# Altium project ESP32_S3_ETHERNET.PrjPcb
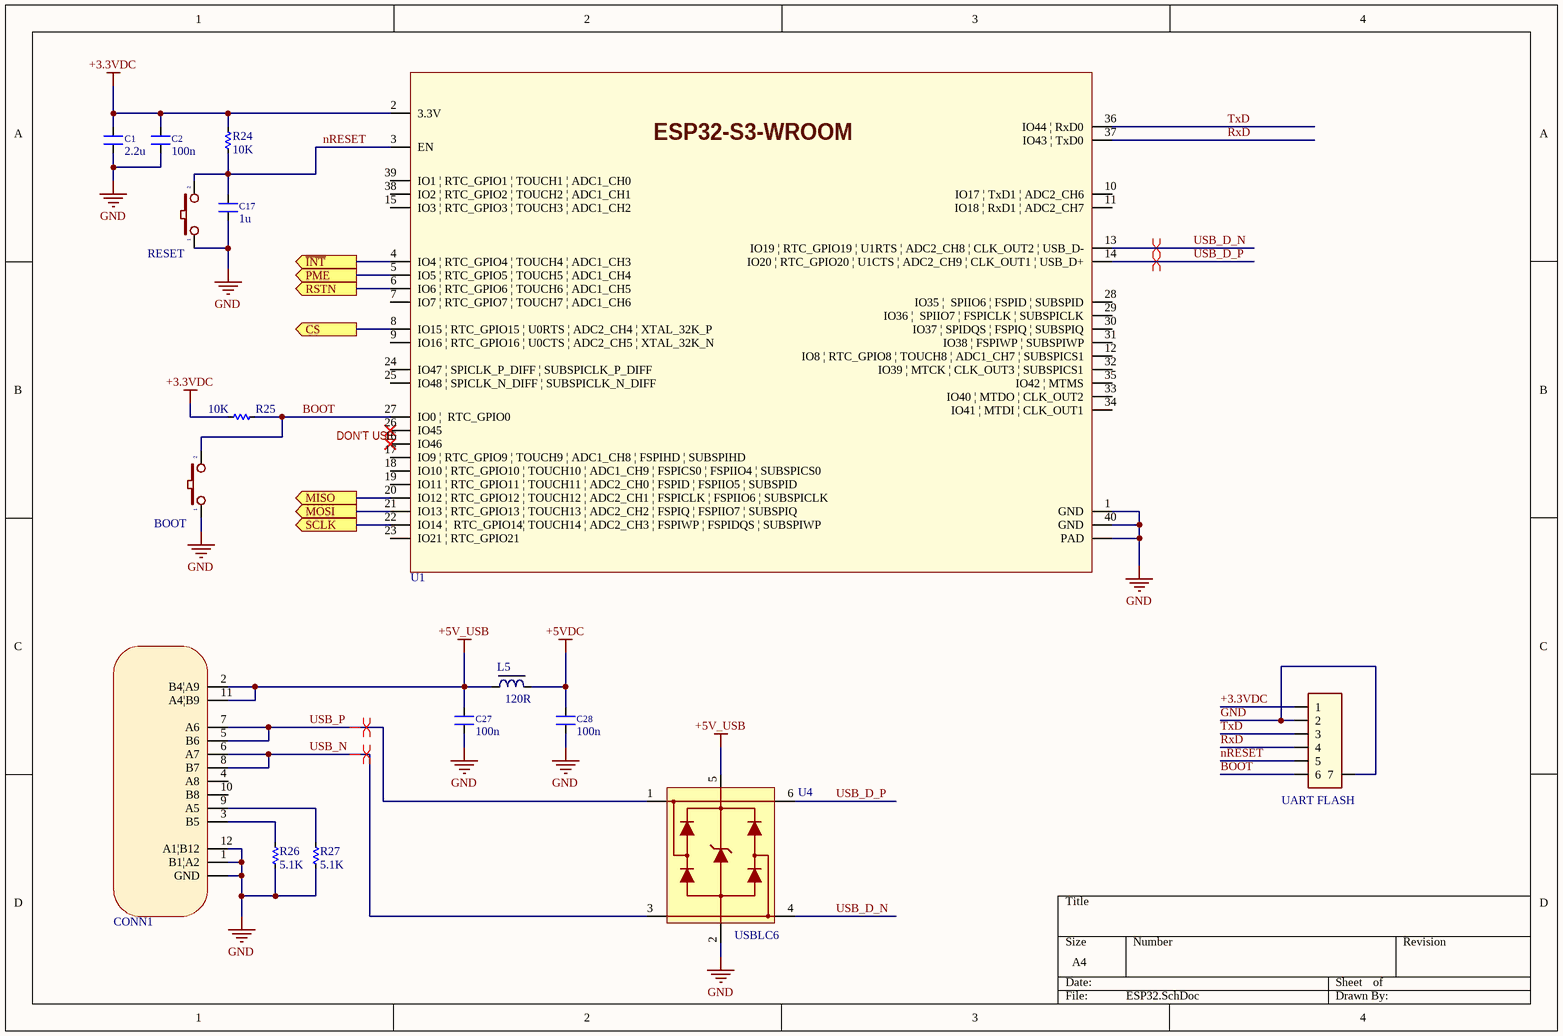
[diagram p0: ESP32.SchDoc]
3 sheets, 86 parts. Net scope: flat (ports and power ports of the same name join across sheets).
Board file: V1.0.PcbDoc
Sheets:
  ESP32.SchDoc
  KSZ8851SNL.SchDoc
  POWER.SchDoc

## Sheet ESP32.SchDoc
size A4; SheetNumber: 1; SheetTotal: 3

### Parts
BOOT  BUTTON1  [SW-SMD - 3x4]  (value not drawn)
C1  2.2u  [CN-SMD-0805]
C2  100n  [CN-SMD-0603]
C17  1u  [CN-SMD-0603]
C27  100n  [CN-SMD-0603]
C28  100n  [CN-SMD-0603]
CONN1  USB-C3.1 12PIN  [TYPE-C-31-M-12]  (value not drawn)
L5  120R  [IN-SMD-0603]
R24  10K  [RES-SMD-0603]
R25  10K  [RES-SMD-0603]
R26  5.1K  [RES-SMD-0603]
R27  5.1K  [RES-SMD-0603]
RESET  BUTTON1  [SW-SMD - 3x4]  (value not drawn)
U1  ESP32 S3  [ESP32-S3-WROOM-1/1U]  (value not drawn)
U4  USBLC6  [SOT23-6]
UART_FLASH  CONNECTOR 6P  [JST-PH2.0_6P]  (value not drawn)

### Ports
CS (out), MISO (out), MOSI (out), PME (out), RSTN (out), SCLK (out), ~{INT} (out)

### Nets
+3.3VDC: C1.2 C2.2 R24.2 R25.2 U1.2(3.3V) UART_FLASH.1
+5V_USB: C27.2 CONN1.2(B4|A9) CONN1.11(A4|B9) L5.1 U4.5
+5VDC: C28.2 L5.2
GND: BOOT.1 C1.1 C2.1 C17.1 C27.1 C28.1 CONN1.1(B1|A2) CONN1.12(A1|B12) CONN1.GND R26.2 R27.2 RESET.1 U1.1(GND) U1.40(GND) U1.PAD U4.2 UART_FLASH.2 UART_FLASH.7
BOOT: BOOT.2 R25.1 U1.27(IO0_|__RTC_GPIO0) UART_FLASH.6
nRESET: C17.2 R24.1 RESET.2 U1.3(EN) UART_FLASH.5
RxD: U1.37(IO43_|_TxD0) UART_FLASH.4
TxD: U1.36(IO44_|_RxD0) UART_FLASH.3
USB_D_N: U1.13(IO19_|_RTC_GPIO19_|_U1RTS_|_ADC2_CH8_|_CLK_OUT2_|_USB_D-) U4.4
USB_D_P: U1.14(IO20_|_RTC_GPIO20_|_U1CTS_|_ADC2_CH9_|_CLK_OUT1_|_USB_D+) U4.6
USB_N: CONN1.6(A7) CONN1.8(B7) U4.3
USB_P: CONN1.5(B6) CONN1.7(A6) U4.1
NetCONN1_3: CONN1.3(B5) R26.1
NetCONN1_9: CONN1.9(A5) R27.1
NetD1_2: U1.6(IO6_|_RTC_GPIO6_|_TOUCH6_|_ADC1_CH5) ; port RSTN
NetR1_1: U1.4(IO4_|_RTC_GPIO4_|_TOUCH4_|_ADC1_CH3) ; port ~{INT}
NetR2_1: U1.20(IO12_|_RTC_GPIO12_|_TOUCH12_|_ADC2_CH1_|_FSPICLK_|_FSPIIO6_|_SUBSPICLK) ; port MISO
NetR3_1: U1.21(IO13_|_RTC_GPIO13_|_TOUCH13_|_ADC2_CH2_|_FSPIQ_|_FSPIIO7_|_SUBSPIQ) ; port MOSI
NetR4_1: U1.22(IO14_|__RTC_GPIO14|_TOUCH14_|_ADC2_CH3_|_FSPIWP_|_FSPIDQS_|_SUBSPIWP) ; port SCLK
NetR6_1: U1.8(IO15_|_RTC_GPIO15_|_U0RTS_|_ADC2_CH4_|_XTAL_32K_P) ; port CS
NetR9_1: U1.5(IO5_|_RTC_GPIO5_|_TOUCH5_|_ADC1_CH4) ; port PME

Not connected (* = marked no-connect by the designer): CONN1 4(A8) 10(B8); U1 7(IO7_|_RTC_GPIO7_|_TOUCH7_|_ADC1_CH6) 9(IO16_|_RTC_GPIO16_|_U0CTS_|_ADC2_CH5_|_XTAL_32K_N) 10(IO17_|_TxD1_|_ADC2_CH6) 11(IO18_|_RxD1_|_ADC2_CH7) 12(IO8_|_RTC_GPIO8_|_TOUCH8_|_ADC1_CH7_|_SUBSPICS1) 15(IO3_|_RTC_GPIO3_|_TOUCH3_|_ADC1_CH2) 16(IO46)* 17(IO9_|_RTC_GPIO9_|_TOUCH9_|_ADC1_CH8_|_FSPIHD_|_SUBSPIHD) 18(IO10_|_RTC_GPIO10_|_TOUCH10_|_ADC1_CH9_|_FSPICS0_|_FSPIIO4_|_SUBSPICS0) 19(IO11_|_RTC_GPIO11_|_TOUCH11_|_ADC2_CH0_|_FSPID_|_FSPIIO5_|_SUBSPID) 23(IO21_|_RTC_GPIO21) 24(IO47_|_SPICLK_P_DIFF_|_SUBSPICLK_P_DIFF) 25(IO48_|_SPICLK_N_DIFF_|_SUBSPICLK_N_DIFF) 26(IO45)* 28(IO35_|__SPIIO6_|_FSPID_|_SUBSPID) 29(IO36_|__SPIIO7_|_FSPICLK_|_SUBSPICLK) 30(IO37_|_SPIDQS_|_FSPIQ_|_SUBSPIQ) 31(IO38_|_FSPIWP_|_SUBSPIWP) 32(IO39_|_MTCK_|_CLK_OUT3_|_SUBSPICS1) 33(IO40_|_MTDO_|_CLK_OUT2) 34(IO41_|_MTDI_|_CLK_OUT1) 35(IO42_|_MTMS) 38(IO2_|_RTC_GPIO2_|_TOUCH2_|_ADC1_CH1) 39(IO1_|_RTC_GPIO1_|_TOUCH1_|_ADC1_CH0)

### Layout directives
differential pair: USB_D_N, USB_D_P, USB_N, USB_P

### Notes on the sheet
- (near U1) DON'T USE
- (in symbol ESP32 S3) ESP32-S3-WROOM

### Library data of the parts
BOOT RESET = BUTTON1: Value: 1N4007
C1 C2 C17 C27 C28 = CAP SMD: Value: 0,1uF/300V; Designed by: VanDungEvn
L5 = inductor-SMD: Value: 150 mH
R24-R27 = Res-SMD: Resistor; Manufacturer: Generic Components; Class: Passive; Published: 08/06/2000; Publisher: Altium Hobart Technology Centre
U1 = ESP32 S3: 2.4 GHz Wi-Fi (802.11 b/g/n) and Bluetooth® 5 (LE) module / Built around ESP32-S3 series of SoCs, Xtensa® dual-core 32-bit LX7 microprocessor / Flash up to 16 MB, PSRAM up to 16 MB / Up to 36 GPIOs, rich set of peripherals / On-board PCB antenna or external antenna connector
U4 = USBLC6: USB ESD

## Sheet KSZ8851SNL.SchDoc
size 355 x 203 mm; SheetNumber: 2; SheetTotal: 3
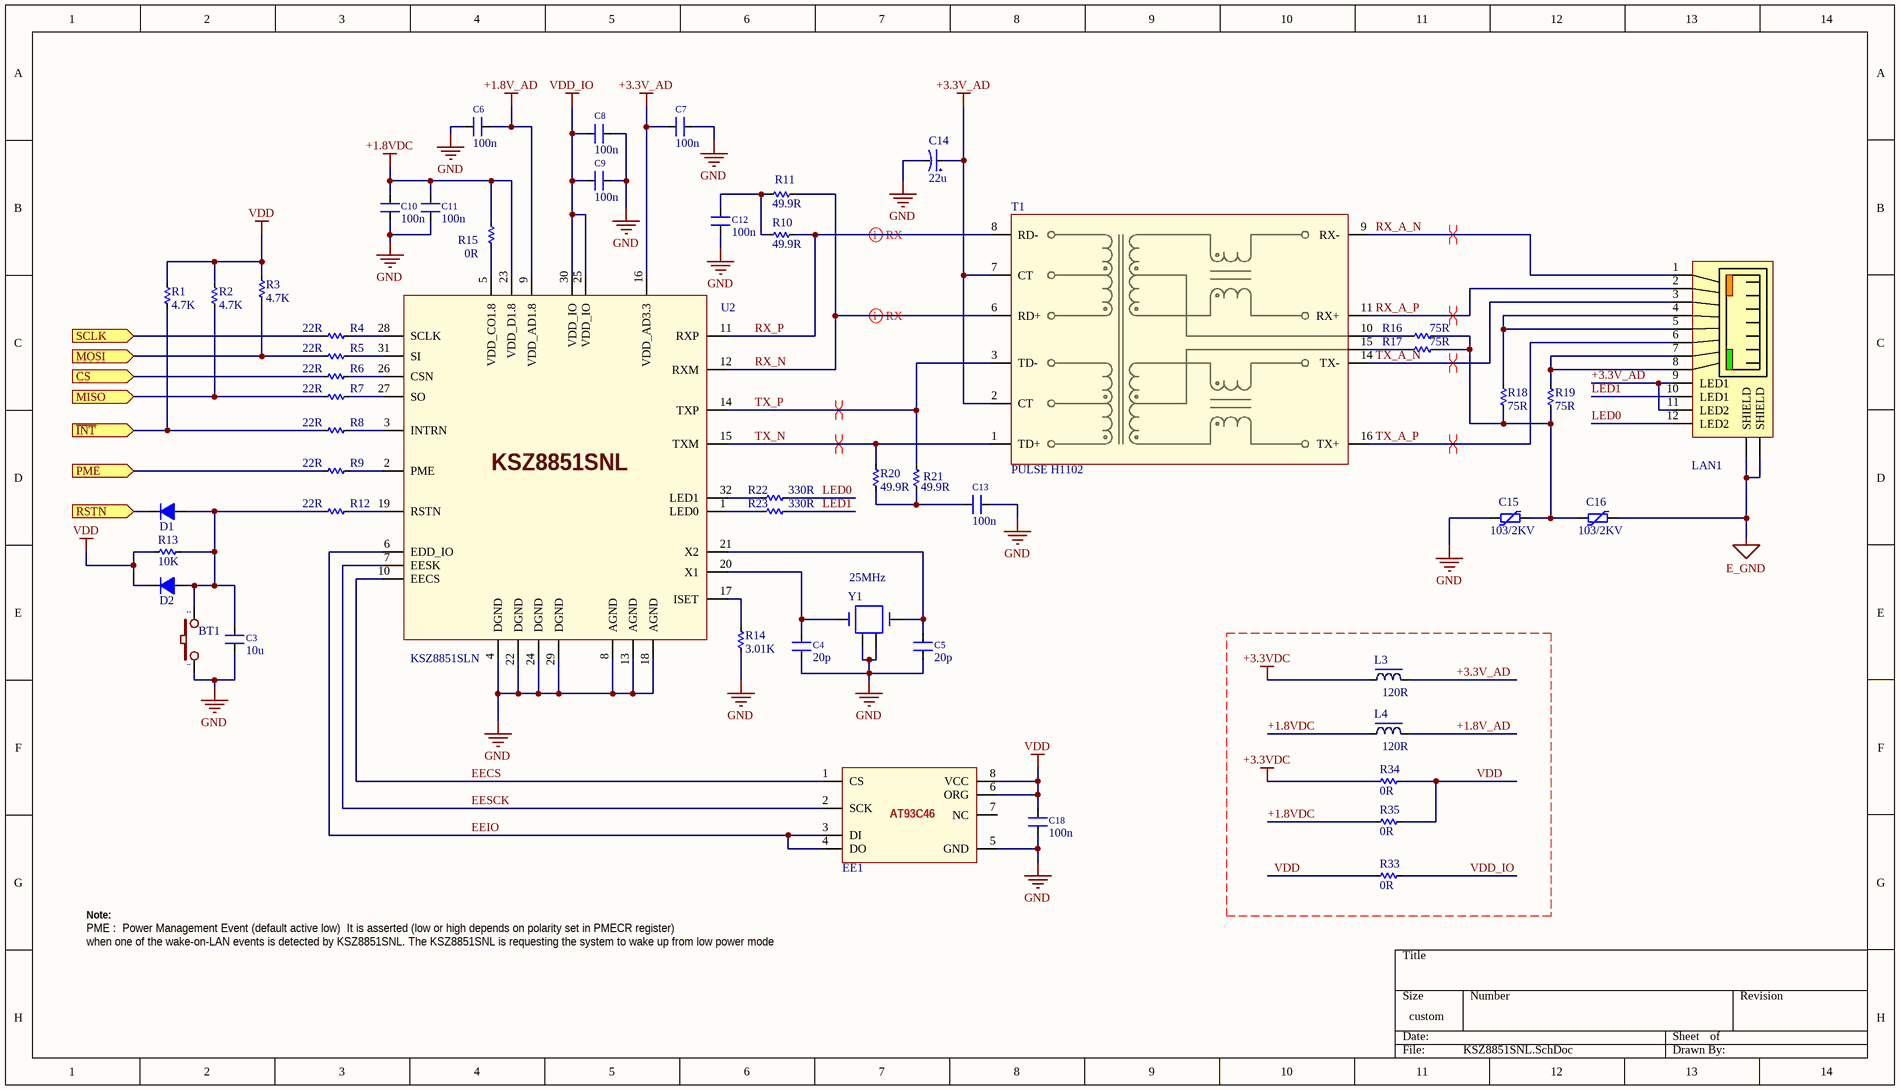
[diagram p1: KSZ8851SNL.SchDoc]

### Parts
BT1  BUTTON1  [SW-SMD - 3x4]  (value not drawn)
C3  10u  [CN-SMD-1206]
C4  20p  [CN-SMD-0603]
C5  20p  [CN-SMD-0603]
C6  100n  [CN-SMD-0805]
C7  100n  [CN-SMD-0805]
C8  100n  [CN-SMD-0805]
C9  100n  [CN-SMD-0805]
C10  100n  [CN-SMD-0805]
C11  100n  [CN-SMD-0805]
C12  100n  [CN-SMD-0805]
C13  100n  [CN-SMD-0805]
C14  22u  [CAP-ALU-SMD-5.5x5.5]
C15  103/2KV  [MOV-7D]
C16  103/2KV  [MOV-7D]
C18  100n  [CN-SMD-0805]
D1  Diode  1N4007  [SOD-123]  (value not drawn)
D2  Diode  1N4007  [SOD-123]  (value not drawn)
EE1  AT93C46D  [SOP-8_mini]  (value not drawn)
L3  120R  [IN-SMD-0603]
L4  120R  [IN-SMD-0603]
LAN1  RJHSE-5381  [RJ45]  (value not drawn)
R1  4.7K  [RES-SMD-0603]
R2  4.7K  [RES-SMD-0603]
R3  4.7K  [RES-SMD-0603]
R4  22R  [RES-SMD-0603]
R5  22R  [RES-SMD-0603]
R6  22R  [RES-SMD-0603]
R7  22R  [RES-SMD-0603]
R8  22R  [RES-SMD-0603]
R9  22R  [RES-SMD-0603]
R10  49.9R  [RES-SMD-0805]
R11  49.9R  [RES-SMD-0805]
R12  22R  [RES-SMD-0603]
R13  10K  [RES-SMD-0603]
R14  3.01K  [RES-SMD-0603]
R15  0R  [RES-SMD-0603]
R16  75R  [RES-SMD-0805]
R17  75R  [RES-SMD-0805]
R18  75R  [RES-SMD-0805]
R19  75R  [RES-SMD-0805]
R20  49.9R  [RES-SMD-0805]
R21  49.9R  [RES-SMD-0805]
R22  330R  [RES-SMD-0805]
R23  330R  [RES-SMD-0805]
R33  0R  [RES-SMD-0805]
R34  0R  [RES-SMD-0805]
R35  0R  [RES-SMD-0805]
T1  PULSE H1102  [PULSE-H1102NL]
U2  KSZ8851SLN  [QFN32-32]
Y1  25MHz  [Crystal 4 pin SMD 32x25]

### Ports
CS (in), MISO (in), MOSI (in), PME (in), RSTN (in), SCLK (in), ~{INT} (in)

### Nets
+1.8V_AD: C6.2 L4.2 U2.9(VDD_AD1.8)
+1.8VDC: C10.1 C11.1 L4.1 R15.2 R35.1 U2.23(VDD_D1.8)
+3.3V_AD: C7.1 C14.1 L3.2 LAN1.9(LED1) LAN1.11(LED2) T1.2(CT) T1.7(CT) U2.16(VDD_AD3.3)
+3.3VDC: L3.1 R34.1
E_GND: C16.2 LAN1.SHIELD
GND: BT1.1 C3.1 C4.1 C5.1 C6.1 C7.2 C8.2 C9.2 C10.2 C11.2 C12.2 C13.1 C14.2 C15.1 C18.2 EE1.5(GND) R14.2 U2.4(DGND) U2.8(AGND) U2.13(AGND) U2.18(AGND) U2.22(DGND) U2.24(DGND) U2.29(DGND) Y1.2(GND) Y1.4(GND)
VDD: C18.1 D2.2 EE1.6(ORG) EE1.8(VCC) R1.2 R2.2 R3.2 R13.2 R33.1 R34.2 R35.2
VDD_IO: C8.1 C9.1 R33.2 U2.25(VDD_IO) U2.30(VDD_IO)
EECS: EE1.1(CS) U2.10(EECS)
EEIO: EE1.3(DI) EE1.4(DO) U2.6(EDD_IO)
EESCK: EE1.2(SCK) U2.7(EESK)
LED0: LAN1.12(LED2) R22.2
LED1: LAN1.10(LED1) R23.2
RX_A_N: LAN1.1 T1.9(RX-)
RX_A_P: LAN1.2 T1.11(RX+)
RX_N: R11.1 T1.6(RD+) U2.12(RXM)
RX_P: R10.1 T1.8(RD-) U2.11(RXP)
TX_A_N: LAN1.3 T1.14(TX-)
TX_A_P: LAN1.6 T1.16(TX+)
TX_N: R20.1 T1.1(TD+) U2.15(TXM)
TX_P: R21.1 T1.3(TD-) U2.14(TXP)
NetBT1_2: BT1.2 C3.2 D1.1 D2.1 R12.1 R13.1
NetC4_2: C4.2 U2.20(X1) Y1.1(OSC1)
NetC5_2: C5.2 U2.21(X2) Y1.3(OSC2)
NetC12_1: C12.1 R10.2 R11.2
NetC13_2: C13.2 R20.2 R21.2
NetC15_2: C15.2 C16.1 R16.1 R17.1 R18.2 R19.2
NetD1_2: D1.2 ; port RSTN
NetLAN1_4: LAN1.4 LAN1.5 R18.1
NetLAN1_7: LAN1.7 LAN1.8 R19.1
NetR1_1: R1.1 R8.1 ; port ~{INT}
NetR2_1: R2.1 R7.1 ; port MISO
NetR3_1: R3.1 R5.1 ; port MOSI
NetR4_1: R4.1 ; port SCLK
NetR4_2: R4.2 U2.28(SCLK)
NetR5_2: R5.2 U2.31(SI)
NetR6_1: R6.1 ; port CS
NetR6_2: R6.2 U2.26(CSN)
NetR7_2: R7.2 U2.27(SO)
NetR8_2: R8.2 U2.3(INTRN)
NetR9_1: R9.1 ; port PME
NetR9_2: R9.2 U2.2(PME)
NetR12_2: R12.2 U2.19(RSTN)
NetR14_1: R14.1 U2.17(ISET)
NetR15_1: R15.1 U2.5(VDD_CO1.8)
NetR16_2: R16.2 T1.10
NetR17_2: R17.2 T1.15
NetR22_1: R22.1 U2.32(LED1)
NetR23_1: R23.1 U2.1(LED0)

Not connected (* = marked no-connect by the designer): EE1 7(NC)

### Layout directives
differential pair: RX_A_N, RX_A_P, RX_N, RX_P, TX_A_N, TX_A_P, TX_N, TX_P

### Notes on the sheet
- PME :  Power Management Event (default active low)  It is asserted (low or high depends on polarity set in PMECR register)
- Note:
- when one of the wake-on-LAN events is detected by KSZ8851SNL. The KSZ8851SNL is requesting the system to wake up from low power mode
- (in symbol AT93C46D) AT93C46
- (in symbol KSZ8851SLN) KSZ8851SNL

### Library data of the parts
BT1 = BUTTON1: Value: 1N4007
C3-C13 C18 = CAP SMD: as C1 on sheet ESP32
C14 = CAP-ALU-SMD: Published: 8-Jun-2000; LatestRevisionDate: 17-Jul-2002; LatestRevisionNote: Re-released for DXP Platform.; PackageReference: POLAR0.8; Publisher: Altium Limited
C15 C16 = MOV
D1 D2 = Diode  1N4007: Diode 1A; Value: 1N4007
EE1 = AT93C46D: 3-wire Serial EEPROM
L3 L4 = inductor-SMD: Value: 150 mH
LAN1 = RJHSE-5381: https://pdf1.alldatasheet.com/datasheet-pdf/view/585698/AMPHENOL/RJHSE-5381.html
R1-R23 R33-R35 = Res-SMD: as R24 on sheet ESP32; Published: 08/06/2000; Publisher: Altium Hobart Technology Centre
Y1 = XTAL_4Pin SMD: Crystal Oscillator; Published: 8-Jun-2000; LatestRevisionDate: 17-Jul-2002; LatestRevisionNote: Re-released for DXP Platform.; PackageReference: R38; Publisher: Altium Limited

## Sheet POWER.SchDoc
size A; SheetNumber: 3; SheetTotal: 3
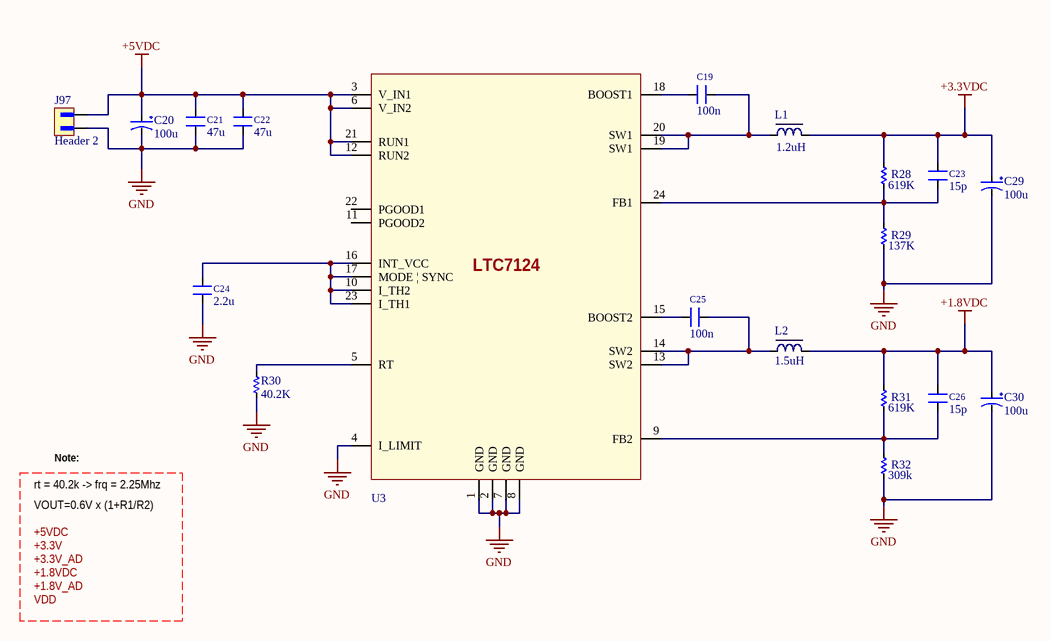
[diagram p2: POWER.SchDoc]

### Parts
C19  100n  [CN-SMD-0603]
C20  100u  [CAP-ALU-SMD-5x5.5x1.4]
C21  47u  [SM-CAP-3225]
C22  47u  [SM-CAP-3225]
C23  15p  [CN-SMD-0603]
C24  2.2u  [CN-SMD-0805]
C25  100n  [CN-SMD-0603]
C26  15p  [CN-SMD-0603]
C29  100u  [CAP-ALU-SMD-5x5.5x1.4]
C30  100u  [CAP-ALU-SMD-5x5.5x1.4]
J97  Header 2  [JST B2B-PH-SM4-TB (LF)(SN)]
L1  1.2uH  [L-SMD-06030-7.4x6.6X3]
L2  1.5uH  [L-SMD-06030-7.4x6.6X3]
R28  619K  [RES-SMD-0603]
R29  137K  [RES-SMD-0603]
R30  40.2K  [RES-SMD-0603]
R31  619K  [RES-SMD-0603]
R32  309k  [RES-SMD-0603]
U3  LTC7124  [24-Lead Plastic QFN (3mm × 5mm)]  (value not drawn)

### Nets
+1.8VDC: C26.1 C30.1 L2.2 R31.2
+3.3VDC: C23.1 C29.1 L1.2 R28.2
+5VDC: C20.1 C21.2 C22.2 J97.2 U3.3(V_IN1) U3.6(V_IN2) U3.12(RUN2) U3.21(RUN1)
GND: C20.2 C21.1 C22.1 C24.1 C29.2 C30.2 J97.1 R29.1 R30.1 R32.1 U3.1(GND) U3.2(GND) U3.4(I_LIMIT) U3.7(GND) U3.8(GND)
NetC19_1: C19.1 L1.1 U3.19(SW1) U3.20(SW1)
NetC19_2: C19.2 U3.18(BOOST1)
NetC23_2: C23.2 R28.1 R29.2 U3.24(FB1)
NetC24_2: C24.2 U3.10(I_TH2) U3.16(INT_VCC) U3.17(MODE_|_SYNC) U3.23(I_TH1)
NetC25_1: C25.1 L2.1 U3.13(SW2) U3.14(SW2)
NetC25_2: C25.2 U3.15(BOOST2)
NetC26_2: C26.2 R31.1 R32.2 U3.9(FB2)
NetR30_2: R30.2 U3.5(RT)

Not connected (* = marked no-connect by the designer): U3 11(PGOOD2) 22(PGOOD1)

### Notes on the sheet
- rt = 40.2k ->
- Note:
- frq = 2.25Mhz
- VOUT=0.6V x (1+R1/R2)
- +5VDC
- +3.3V
- +3.3V_AD
- +1.8VDC
- +1.8V_AD
- VDD

### Library data of the parts
C19 C21-C26 = CAP SMD: as C1 on sheet ESP32
C20 C29 C30 = CAP-ALU-SMD: Published: 8-Jun-2000; LatestRevisionDate: 17-Jul-2002; LatestRevisionNote: Re-released for DXP Platform.; PackageReference: POLAR0.8; Publisher: Altium Limited
J97 = Header 2: Parameter 1: JST - GH - SMD (V) - 2Pin - 1.25mm; ComponentLink1Description: New link; ComponentLink1URL: C145937
L1 L2 = inductor-SMD: Value: 150 mH
R28-R32 = Res-SMD: as R24 on sheet ESP32; Published: 08/06/2000; Publisher: Altium Hobart Technology Centre
U3 = LTC7124: 17V, Dual 3.5A Synchronous Step-Down / Regulator with Ultralow Quiescent Current

## Nets that join several sheets
+1.8VDC: KSZ8851SNL (6 pins), POWER (C26.1 C30.1 L2.2 R31.2)
+3.3VDC: ESP32 (6 pins), KSZ8851SNL (L3.1 R34.1), POWER (C23.1 C29.1 L1.2 R28.2)
+5VDC: ESP32 (C28.2 L5.2), POWER (8 pins)
GND: ESP32 (18 pins), KSZ8851SNL (26 pins), POWER (15 pins)
NetD1_2: ESP32 (U1.6), KSZ8851SNL (D1.2)
NetR1_1: ESP32 (U1.4), KSZ8851SNL (R1.1 R8.1)
NetR2_1: ESP32 (U1.20), KSZ8851SNL (R2.1 R7.1)
NetR3_1: ESP32 (U1.21), KSZ8851SNL (R3.1 R5.1)
NetR4_1: ESP32 (U1.22), KSZ8851SNL (R4.1)
NetR6_1: ESP32 (U1.8), KSZ8851SNL (R6.1)
NetR9_1: ESP32 (U1.5), KSZ8851SNL (R9.1)